# EAGLE design BatterySpacer1 (EAGLE 8.3.1)
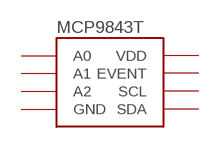
[diagram p0: schematic, sheet 1]

## Parts
IC1  MCP9843T  [TSSOP]
Unconnected: IC1.P$1(A0) IC1.P$2(A1) IC1.P$3(A2) IC1.P$4(GND) IC1.P$5(VDD) IC1.P$6(EVENT) IC1.P$7(SCL) IC1.P$8(SDA)

## Library data of the parts
IC1 = MarkIIEaglelbr:MCP9843T

## Board
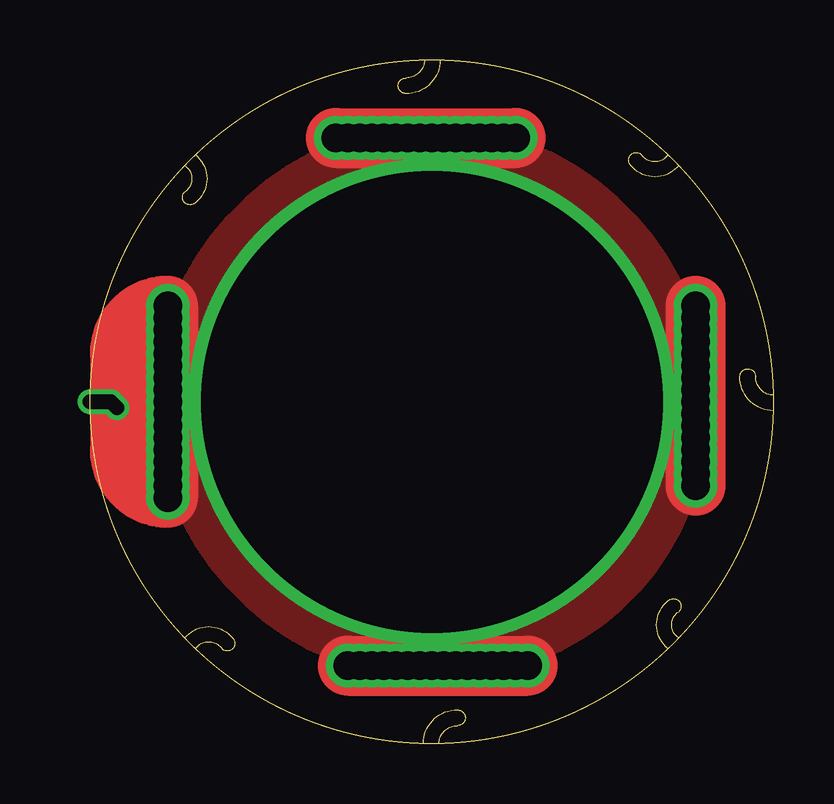
[diagram p1: board, top side]
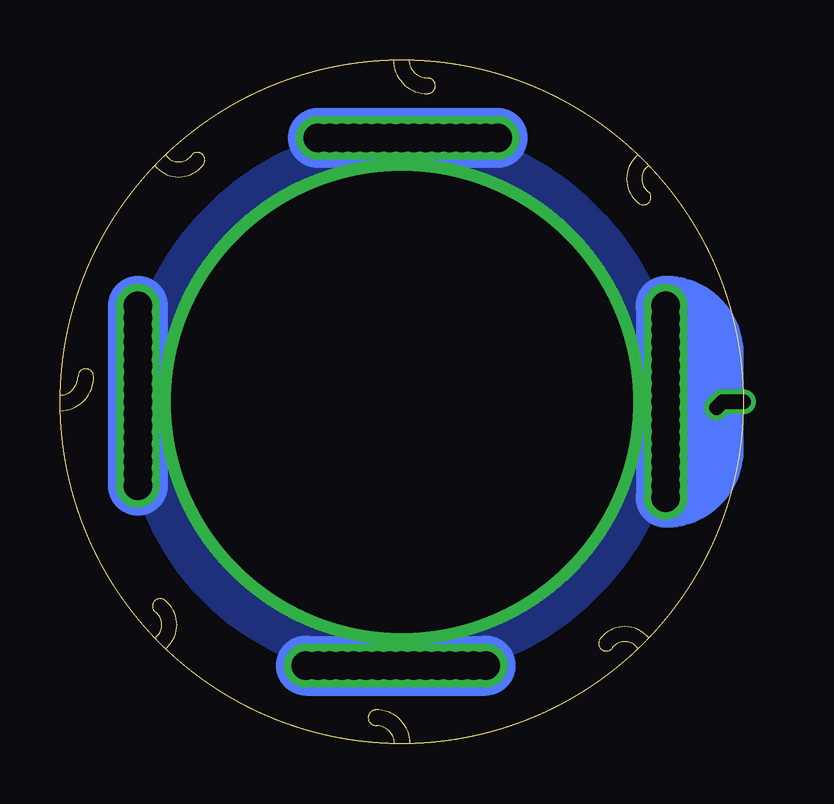
[diagram p2: board, bottom side, seen from below]

Size 28.5 x 28.5 mm. Coordinates in mm from the lower left corner, seen from the top.
Outline: 3.95,24.1 arc-114 3.95,23 arc180 4.4,22.55 arc102 4.4,24.55
Outline: 24.1,24.55 arc-114 23,24.55 arc180 22.55,24.1 arc102 24.55,24.1
Outline: 4.4,3.95 arc-114 5.5,3.95 arc180 5.95,4.4 arc102 3.95,4.4
Outline: 24.55,4.4 arc-114 24.55,5.5 arc180 24.1,5.95 arc102 24.1,3.95
Outline: 14.55,0 arc-90 15.32,0.75 arc180 15.32,1.4 arc91 13.9,0
Outline: 28.5,14.53 arc-90 27.75,15.3 arc180 27.1,15.3 arc91 28.5,13.88
Outline: 13.95,28.5 arc-90 13.18,27.75 arc180 13.18,27.1 arc91 14.6,28.5
Outline: circle at 14.25,14.25 radius 14.25
Copper layers (1*16): Top 0.035mm / dielectric 1.5mm / Bottom 0.035mm
Design rules "default": minimum track width 6mil, minimum drill 0.35mm, track to track 6mil, track to pad 6mil, pad to pad 6mil, via to via 6mil, smd to smd 6mil, copper to edge 40mil, drill to drill 6mil, minimum pad ring 10mil, minimum via ring 8mil, stop-mask expansion 4mil, vias tented up to drill 0mil, thermal gap 10mil

### Placement (x,y rotation side)

### Tracks (layer width: path | path; a pad name or v marks a point on that pad's centre or on a via)
BAT  (via drill 0.6, 1.2, 19.25)
  Top 0.1: 1.25,12.25 1.25,13.25 v0.25,14.25
  Top 2.5: v10.25,25.25 v17.75,25.25 | v10.75,3.25 v18.25,3.25 | v25.25,10.75 v25.25,18.25 | v3.25,18.25 v3.25,10.25 arc-90 1.25,12.25 1.25,16.25 arc-90 v3.25,18.25
  Bottom 2.5: v10.25,25.25 v17.75,25.25 | v25.25,10.75 v25.25,18.25 | v18.25,3.25 v10.75,3.25 | v3.25,10.25 arc-90 1.25,12.25 1.25,16.25 arc-90 v3.25,18.25 v3.25,10.25
  other vias: 14.25,14.25 3.25,14.25 3.25,14.75 3.25,15.25 3.25,15.75 3.25,16.25 3.25,16.75 3.25,13.75 3.25,17.25 3.25,17.75 3.25,10.75 3.25,11.25 3.25,11.75 3.25,12.25 3.25,12.75 3.25,13.25 14.25,3.25 13.75,3.25 13.25,3.25 12.75,3.25 12.25,3.25 11.75,3.25 14.75,3.25 11.25,3.25 25.25,11.25 25.25,11.75 25.25,12.25 25.25,12.75 25.25,13.25 25.25,13.75 13.75,25.25 13.25,25.25 12.75,25.25 12.25,25.25 11.75,25.25 11.25,25.25 14.25,25.25 10.75,25.25 17.25,25.25 16.75,25.25 16.25,25.25 15.75,25.25 15.25,25.25 14.75,25.25 17.75,3.25 17.25,3.25 16.75,3.25 16.25,3.25 15.75,3.25 15.25,3.25 25.25,14.75 25.25,15.25 25.25,15.75 25.25,16.25 25.25,16.75 25.25,17.25 25.25,14.25 25.25,17.75
  pour Top: 14.25,2.75 arc-90 2.75,14.25 arc-90 14.25,25.75 arc-90 25.75,14.25 25.75,13.75 arc-90 14.75,2.75
  pour Bottom: 14.25,2.75 arc-90 2.75,14.25 arc-90 14.25,25.75 arc-90 25.75,14.25 25.75,13.75 arc-90 14.75,2.75
BAT1  (via drill 0.6)
  other vias: 0.75,14.25 1,14.12 1.12,14
N$1  (via drill 0.6)
  other vias: 0.5,14.25
N$2  (via drill 0.6)
  other vias: 0.62,14.25
N$3  (via drill 0.6)
  other vias: 0.88,14.25
N$21  (via drill 0.6)
  other vias: 0,14.25
N$22  (via drill 0.6)
  other vias: 0.12,14.25
N$24  (via drill 0.6)
  other vias: 0.38,14.25